# EAGLE design ISP breakout (EAGLE 6.3)
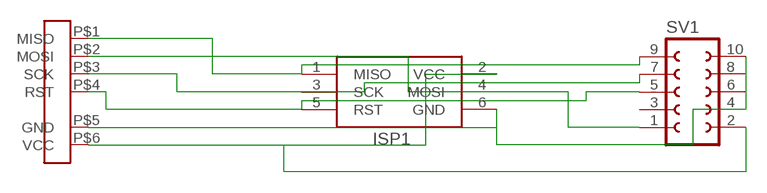
[diagram p0: schematic, sheet 1]

## Parts
ISP1  AVRISP-6  [AVRISP]
SV1  FE05-2  [FE05-2]
U$1  LIN_ISP  [LINEAR_ISP]

## Nets
N$1: ISP1.2(VCC) SV1.2 U$1.P$6(VCC)
N$3: ISP1.4(MOSI) SV1.1 U$1.P$2(MOSI)
N$4: ISP1.1(MISO) SV1.9 U$1.P$1(MISO)
N$5: ISP1.3(SCK) SV1.7 U$1.P$3(SCK)
N$6: ISP1.5(RST) SV1.5 U$1.P$4(RST)
N$10: ISP1.6(GND) SV1.4 SV1.6 SV1.8 SV1.10 U$1.P$5(GND)
Unconnected: SV1.3

## Library data of the parts
ISP1 = adafruit:AVRISP: AVR ISP HEADER Standard 6 pin header for AVR programming
SV1 = con-lsta:FE05-2: FEMALE HEADER; OC_FARNELL: unknown; OC_NEWARK: unknown
U$1 = Legot:LIN_ISP: ISP or ICSP for AVR chips. 6 pin 1: Mosi 2: Miso 3: SCK 4: RST 5: GND 6: VCC

## Board
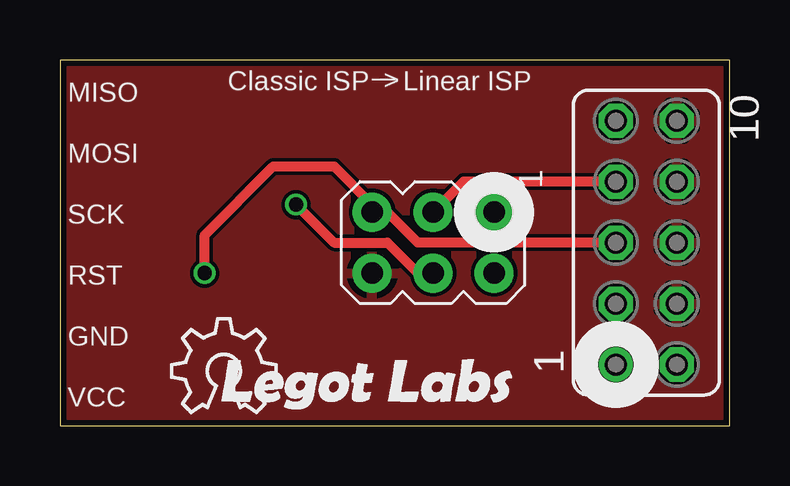
[diagram p1: board, top side]
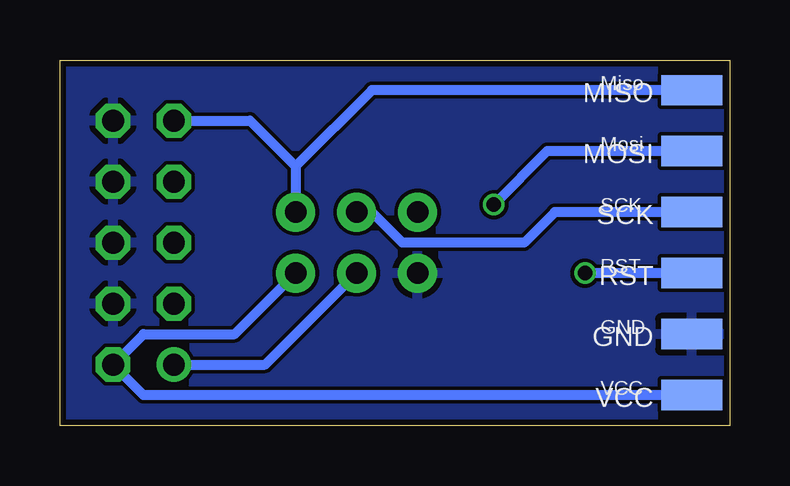
[diagram p2: board, bottom side, seen from below]

Size 27.93 x 15.23 mm. Coordinates in mm from the lower left corner, seen from the top.
Outline: 0,0 27.93,0 27.93,15.23 0,15.23 0,0
Copper layers (1*16): Top 0.035mm / dielectric 1.5mm / Bottom 0.035mm
Design rules "Fusion_eagle_rule_v1.1": minimum track width 6mil, minimum drill 12mil, track to track 6mil, track to pad 6mil, pad to pad 6mil, via to via 6mil, smd to smd 0mil, copper to edge 10mil, drill to drill 10mil, minimum pad ring 10mil, minimum via ring 6mil, stop-mask expansion 2mil, vias tented up to drill 100mil, thermal gap 10mil

### Footprints (pad centres in the part's own frame; a part is rotated, then mirrored left to right if it is on the bottom)
AVRISP = drill 0.9 pad 1.626: 1 -1.27,2.54; 2 1.27,2.54; 3 -1.27,0; 4 1.27,0; 5 -1.27,-2.54; 6 1.27,-2.54
FE05-2 = drill 0.914: 1 -5.08,1.27 | drill 0.914 octagon: 2 -5.08,-1.27; 3 -2.54,1.27; 4 -2.54,-1.27; 5 0,1.27; 6 0,-1.27; 7 2.54,1.27; 8 2.54,-1.27; 9 5.08,1.27; 10 5.08,-1.27
LINEAR_ISP = smd 1.27 x 2.54: P$1 -6.35,0; P$2 -3.81,0; P$3 -1.27,0; P$4 1.27,0; P$5 3.81,0; P$6 6.35,0

### Placement (x,y rotation side)
ISP1  15.56,7.62 270 top
SV1  24.45,7.62 90 top
U$1  1.59,7.62 270 bottom

### Tracks (layer width: path | path; a pad name or v marks a point on that pad's centre or on a via)
N$1
  Bottom 0.406: ISP1.2 20.64,3.81 24.45,3.81 SV1.2 24.45,1.27 U$1.P$6
N$3  (via drill 0.6)
  Top 0.406: v9.84,9.21 11.43,7.62 13.65,7.62 14.92,6.35 ISP1.4
  Bottom 0.406: SV1.1 19.37,2.54 ISP1.4 | U$1.P$2 7.62,11.43 v9.84,9.21
N$4
  Bottom 0.406: U$1.P$1 14.92,13.97 18.1,10.79 | 18.1,10.79 ISP1.1 | SV1.9 20,12.7 18.1,10.79
N$5
  Top 0.406: SV1.7 16.83,10.16 ISP1.3
  Bottom 0.406: U$1.P$3 7.3,8.89 8.57,7.62 13.65,7.62 14.92,8.89 ISP1.3
N$6  (via drill 0.6)
  Top 0.406: SV1.5 14.92,7.62 13.65,8.89 ISP1.5 13.02,9.21 11.43,10.79 8.89,10.79 6.03,7.94 v6.03,6.35
  Bottom 0.406: U$1.P$4 v6.03,6.35
N$10
  pour Top: 27.62,14.92 0.32,14.92 0.32,0.32 27.62,0.32
  pour Bottom: 0.32,14.92 0.32,0.32 27.62,0.32 27.62,14.92

### Text on the board
tNames: _ | _ | Classic ISP | > | Linear ISP | MISO | MOSI | SCK | RST | GND | VCC | C:/Program Files (x86)/EAGLE_PCB/Legot Labs-Open Source BITMAP.bmp
bNames: MISO | MOSI | SCK | RST | GND | VCC